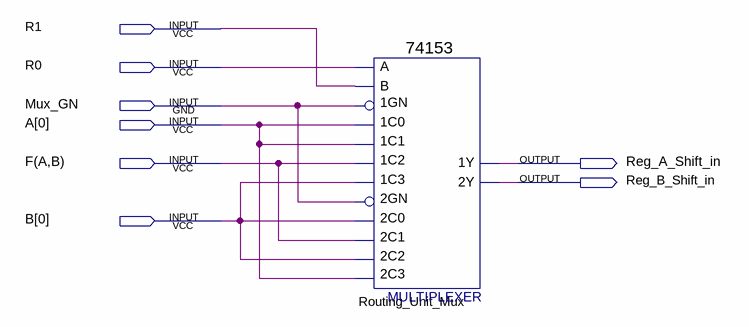
[diagram p0: schematic sheet]
// Quartus schematic 4-bit_logic_processor_schematic_routing_unit.bdf as structural Verilog: 1 symbols, 8 pins
module \4-bit_logic_processor_schematic_routing_unit  (
  input  R1,
  input  R0,
  input  Mux_GN,
  input  [0:0] A,
  input  \F(A ,
  input  \B) ,
  input  [0:0] B,
  output Reg_A_Shift_in,
  output Reg_B_Shift_in
);

  wire undriven;

  \74153  Routing_Unit_Mux (
    .\1C1 (A[0]), .\1GN (Mux_GN), .\1C0 (A[0]), .\2C0 (B[0]), .\2GN (Mux_GN), .\2C2 (B[0]), .\1C2 (undriven),
    .\1C3 (B[0]), .B(R1), .A(R0), .\2C1 (undriven), .\2C3 (A[0]), .\1Y (Reg_A_Shift_in), .\2Y (Reg_B_Shift_in));
endmodule
